# Altium schematic sheet MCU023_XDS110_USB_Power.SchDoc
size 431 x 279 mm; Date: Not shown in title block; ApprovedBy: Not shown in title block; CheckedBy: Not shown in title block; Author: Not shown in title block; CompanyName: Not shown in title block; Engineer: Not shown in title block; Organization: Not shown in title block; Address1: Not shown in title block; Address2: Not shown in title block; Address3: Not shown in title block; Address4: Not shown in title block; DocumentNumber: 1; Revision: Use project parameter SCH_Rev; SheetNumber: 3; SheetTotal: 6; PageSetup: Record=PageOptions|CenterHorizontal=True|CenterVertical=True|PrintScale=1.00|XCorrection=1.00|YCorrection=1.00|PrintKind=0|BorderSize=5000000|LeftOffset=0|BottomOffset=0|Orientation=2|PaperLength=1000|PaperWidth=1000|Scale=100|PaperSource=15|PrintQuality=600|MediaType=1|DitherType=10|PaperKind=Letter|PrintScaleMode=1; CurrentTime: Not shown in title block; CurrentDate: Not shown in title block; Time: Not shown in title block; DocumentFullPathAndName: Not shown in title block; DocumentName: Not shown in title block; ModifiedDate: Not shown in title block; ImagePath: Not shown in title block
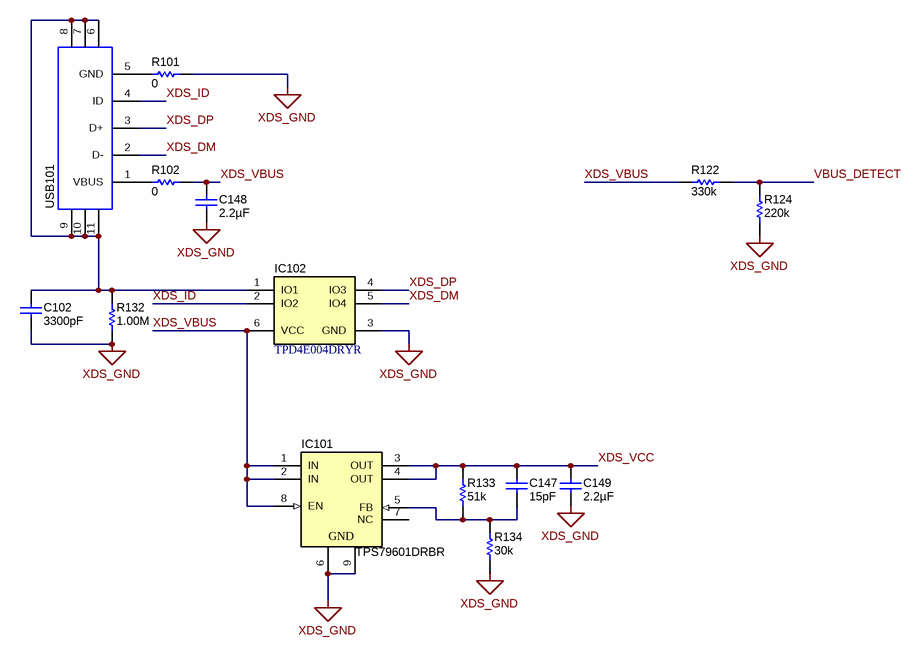
[diagram p0: MCU023_XDS110_USB_Power.SchDoc]

## Parts
C102  ValueDisplayed: 3300pF  [0402]  (hidden comment: GRM155R71H332KA01D)
C147  ValueDisplayed: 15pF  [0402]  (hidden comment: GRM1555C1H150JA01D)
C148  ValueDisplayed: 2.2µF  [0402]  (hidden comment: GRM155R60J225KE95D)
C149  ValueDisplayed: 2.2µF  [0402]  (hidden comment: GRM155R60J225KE95D)
IC101  TPS79601DRBR  [DRB0008B]
IC102  TPD4E004DRYR  [DRY0006A]
R101  ValueDisplayed: 0  [0603]  (hidden comment: CRCW06030000Z0EA)
R102  ValueDisplayed: 0  [0603]  (hidden comment: CRCW06030000Z0EA)
R122  ValueDisplayed: 330k  [0402]  (hidden comment: RC0402FR-07330KL)
R124  ValueDisplayed: 220k  [0402]  (hidden comment: RC0402FR-07220KL)
R132  ValueDisplayed: 1.00M  [0402]  (hidden comment: CRCW04021M00FKED)
R133  ValueDisplayed: 51k  [0402]  (hidden comment: CRCW040251K0JNED)
R134  ValueDisplayed: 30k  [0402]  (hidden comment: CRCW040230K0JNED)
USB101  1051640001  [Molex_1051640001]  (value not drawn)

## Nets
XDS_GND: C102.2 C148.2 C149.2 IC101.6(GND) IC101.9(GND) IC102.3(GND) R101.2 R124.1 R132.1 R134.1
VBUS_DETECT: R122.1 R124.2
XDS_DM: IC102.5(IO4) USB101.2(D-)
XDS_DP: IC102.4(IO3) USB101.3(D+)
XDS_ID: IC102.2(IO2) USB101.4(ID)
XDS_VBUS: C148.1 IC101.1(IN) IC101.2(IN) IC101.8(EN) IC102.6(VCC) R102.2 R122.2
XDS_VCC: C147.1 C149.1 IC101.3(OUT) IC101.4(OUT) R133.2
NetC102_1: C102.1 IC102.1(IO1) R132.2 USB101.6 USB101.7 USB101.8 USB101.9 USB101.10 USB101.11
NetC147_2: C147.2 IC101.5(FB) R133.1 R134.2
NetR101_1: R101.1 USB101.5(GND)
NetR102_1: R102.1 USB101.1(VBUS)

Not connected (* = marked no-connect by the designer): IC101 7(NC)

## Notes on the sheet
- Drawn By:
- SVN Rev:
- Number:
- TID #:
- Orderable:
- Rev:
- Sheet Title:
- File:
- Project Title:
- Designed for:
- Assembly Variant:
- Mod. Date:
- Sheet:
- Size:
- of
- B
- http://www.ti.com
- Texas Instruments and/or its licensors do not warrant the accuracy or completeness of this specification or any information contained therein. Texas Instruments and/or its licensors do not warrant that this design will meet the specifications, will be suitable for your application or fit for any particular purpose, or will operate in an implementation. Texas Instruments and/or its licensors do not warrant that the design is production worthy. You should completely validate and test your design implementation to confirm the system functionality for your application.
- Engineer:
- Contact:
- © Texas Instruments

## Library data of the parts
C102 = GRM155R71H332KA01D: CAP, CERM, 3300 pF, 50 V, +/- 10%, X7R, 0402; Manufacturer: MuRata; Polarized: N; CompType: Capacitor; Value: 3300pF; U/M: EA; Cap_F: 0.0000000033; Tolerance_%: 10; Value1: Unknown; VDC_V: 50; Value2: 50V; TaMin_C: -55; TaMax_C: 125; SizeArea_mm2: 0.5; SizeAreaWB_mm2: 3; SizeX_mm: 1; SizeZ_mm: 0.6; AEC Category: Q200; SymbolVersion: 2008-07-09; PartNumber: GRM155R71H332KA01D; PackageReference: 0402; RoHS: Y; MountType: SMT; Technology: Ceramic; TempCo: X7R; Cap_Case: 0402; SizeY_mm: 0.5; Published: 2008-06-19; Publisher: Texas Instruments; LatestRevisionDate: 2017-04-21; ComponentLink1Description: Datasheet link; ComponentLink1URL: http://search.murata.co.jp/Ceramy/PnsearchViewAction.do?HnOFG=ON&HnNFG=ON&SEL_CNT=50&sLang=en&sKey=GRM155R71H332KA01D&x=9&y=9&search=startwith; Supplier 1: Digi-Key; Supplier Part Number 1: 490-3248-1-ND; Supplier 2: Mouser; Supplier Part Number 2: 81-GRM36X332K50; AEC Qualified: ?
C147 = GRM1555C1H150JA01D: CAP, CERM, 15 pF, 50 V, +/- 5%, C0G/NP0, 0402; Manufacturer: MuRata; Polarized: N; CompType: Capacitor; Value: 15pF; U/M: EA; Cap_F: 0.000000000015; Tolerance_%: 5; Value1: Unknown; VDC_V: 50; Value2: 50V; TaMin_C: -55; TaMax_C: 125; SizeArea_mm2: 0.5; SizeAreaWB_mm2: 3; SizeX_mm: 1; SizeZ_mm: 0.6; AEC Category: Q200; SymbolVersion: 2008-07-09; PartNumber: GRM1555C1H150JA01D; PackageReference: 0402; RoHS: Y; MountType: SMT; Technology: Ceramic; TempCo: C0G/NP0; Cap_Case: 0402; SizeY_mm: 0.5; Published: 2008-06-19; Publisher: Texas Instruments; LatestRevisionDate: 2017-04-21; ComponentLink1Description: Datasheet link; ComponentLink1URL: http://search.murata.co.jp/Ceramy/PnsearchViewAction.do?HnOFG=ON&HnNFG=ON&SEL_CNT=50&sLang=en&sKey=GRM1555C1H150JA01D&x=9&y=9&search=startwith; Supplier 1: Mouser; Supplier Part Number 1: 81-GRM1555C1H150JA1D; AEC Qualified: ?
C148 C149 = GRM155R60J225KE95D: CAP, CERM, 2.2 µF, 6.3 V, +/- 10%, X5R, 0402; Manufacturer: MuRata; Polarized: N; CompType: Capacitor; Value: 2.2uF; U/M: EA; Cap_F: 0.0000022; Tolerance_%: 10; Value1: Unknown; VDC_V: 6.3; Value2: 6.3V; TaMin_C: -55; TaMax_C: 85; SizeArea_mm2: 0.5; SizeAreaWB_mm2: 3; SizeX_mm: 1; SizeZ_mm: 0.6; AEC Category: Q200; SymbolVersion: 2008-07-09; PartNumber: GRM155R60J225KE95D; PackageReference: 0402; RoHS: Y; MountType: SMT; Technology: Ceramic; TempCo: X5R; Cap_Case: 0402; SizeY_mm: 0.5; Published: 2008-06-19; Publisher: Texas Instruments; LatestRevisionDate: 2017-04-21; ComponentLink1Description: Datasheet link; ComponentLink1URL: http://psearch.en.murata.com/capacitor/product/GRM155R60J225KE95%23.pdf; Supplier 1: Mouser; Supplier Part Number 1: 81-GRM155R60J225KE5D; AEC Qualified: N; AEC Grade: N/A
IC101 = TPS79601DRBR: Single Output High PSRR LDO, 1 A, Adjustable 1.2 to 5.5 V Output, 2.7 to 5.5 V Input, 8-pin SON (DRB), -40 to 125 degC, Green (RoHS & no Sb/Br); Manufacturer: Texas Instruments; Alternate PartNumber: Equivalent; Accuracy(%): 2; Iout(Max)(A): 1; Iq(Typ)(mA): 0.26; SubFamily: Single Channel LDO; Vdo(Typ)(mV): 250; Vin(Max)(V): 5.5; Vin(Min)(V): 2.7; Vout Adj(Min)(V): 1.2; Note: TI Supplied; DatasheetVersion: SLVS351N; PackageVersion: 4203482-2/K; PackageReference: DRB0008B; PackageDescription: 8-Pin Plastic Small Outline, Body 3 x 3 mm, Pitch 0.65 mm; Supplier 1: Digi-Key; Supplier Part Number 1: 296-23107-2-ND; Supplier 2: Digi-Key; Supplier Part Number 2: 296-23107-1-ND; Supplier 3: Digi-Key; Supplier Part Number 3: 296-23107-6-ND; Supplier 4: Newark; Supplier Part Number 4: 85M0237; Supplier 5: Mouser; Supplier Part Number 5: 595-TPS79601DRBR; Eco-Plan: Green (RoHS & no Sb/Br); Vout Adj(Max)(V): 5.5; MountType: SMT; PartNumber: TPS79601DRBR; ComponentLink1Description: Manufacturer URL; ComponentLink1URL: http://www.ti.com/; ComponentLink2Description: Datasheet; ComponentLink2URL: http://www.ti.com/general/docs/lit/getliterature.tsp?genericPartNumber=TPS79601&fileType=pdf; ComponentLink3Description: Package Specification; ComponentLink3URL: http://www.ti.com/litv/pdf/mpds118h; Alternate Manufacturer: Texas Instruments
IC102 = TPD4E004DRYR: ESD-Protection Array for High-Speed Data Interfaces, 4 Channels, -40 to +85 degC, 6-pin SON (DRY), Green (RoHS & no Sb/Br); Manufacturer: Texas Instruments; Alternate PartNumber: Equivalent; 1394 / Firewire: TRUE; Breakdown Voltage(Min)(V): 6; IEC 61000-4-2 Air-Gap(+/- kV): 12; IEC 61000-4-2 Contact(+/- kV): 8; IO Capacitance(Typ)(pF): 1.6; IO Leakage Current(nA): 1; SubFamily: ESD Solution; Note: TI Supplied; DatasheetVersion: SLVS729A; PackageVersion: revF, Dec-2011; PackageReference: DRY0006A; PackageDescription: 6-Pin Plastic Small Outline No-Lead, 1 x 1.45 x 0.6 mm Body, 0.5 mm Pitch; Supplier 1: Digi-Key; Supplier Part Number 1: 296-23618-2-ND; Supplier 2: Digi-Key; Supplier Part Number 2: 296-23618-1-ND; Supplier 3: Digi-Key; Supplier Part Number 3: 296-23618-6-ND; Supplier 4: Farnell; Supplier Part Number 4: 1755331; Supplier 5: Newark; Supplier Part Number 5: 85M0177; Supplier 6: Mouser; Supplier Part Number 6: 595-TPD4E004DRYR; Eco-Plan: Green (RoHS & no Sb/Br); Serial ATA / eSATA: TRUE; USB High Speed: TRUE; MountType: SMT; PartNumber: TPD4E004DRYR; ComponentLink1Description: Datasheet; ComponentLink1URL: http://www.ti.com/general/docs/lit/getliterature.tsp?genericPartNumber=TPD4E004&fileType=pdf; ComponentLink2Description: URL Link1; ComponentLink2URL: SamplesURL:http://www.ti.com/product/tpd4e004#samples; Alternate Manufacturer: Texas Instruments
R101 R102 = CRCW06030000Z0EA: RES, 0, 5%, 0.1 W, 0603; Manufacturer: Vishay-Dale; CompType: Resistor; Value: 0; Value_Code: 0000; Tolerance_%: 5; Power_W: 0.1; Value2: 0.1W; VDC_V: 75; TempCo: 200 ppm/C; SizeArea_mm2: 1.28; SizeX_mm: 1.6; SizeY_mm: 0.8; SizeZ_mm: 1; EIA_Code: E24; U/M: EA; AEC Category: Q200; Green_Lifecycle: Active; Green_REACh: Passed; SymbolVersion: 2009-05-29; PartNumber: CRCW06030000Z0EA; PackageReference: 0603; RoHS: Y; Res_ohm: 0; Value1: 5%; MountType: SMT; Technology: Thick Film; Published: 2008-06-26; Publisher: Texas Instruments; LatestRevisionDate: 2017-05-04; ComponentLink1Description: Datasheet link; ComponentLink1URL: http://www.vishay.com/docs/20035/dcrcwe3.pdf; Supplier 1: Digi-Key; Supplier Part Number 1: 541-0.0GCT-ND; Supplier 2: Newark; Supplier Part Number 2: 52K8014; Supplier 3: Mouser; Supplier Part Number 3: 71-CRCW0603-0-E3; AEC Qualified: ?; Green_EU RoHS: Passed with Exemption; Green_EU RoHS-2: Passed
R122 = RC0402FR-07330KL: RES, 330 k, 1%, 0.0625 W, 0402; Manufacturer: Yageo America; CompType: Resistor; Value: 330k; Res_ohm: 330000; Tolerance_%: 1; Power_W: 0.0625; VDC_V: 50; TempCo: 100 ppm/C; SizeArea_mm2: 0.5; SizeZ_mm: 0.6; U/M: EA; AEC Category: Q200; AEC Qualified: N; SymbolVersion: 2009-05-29; PartNumber: RC0402FR-07330KL; PackageReference: 0402; RoHS: Y; Value_Code: 330k; Value1: 1%; Value2: 0.0625W; MountType: SMT; Technology: Thick Film; SizeX_mm: 1; SizeY_mm: 0.5; Published: 2008-06-26; Publisher: Texas Instruments; LatestRevisionDate: 2017-04-13; ComponentLink1Description: Datasheet link; ComponentLink1URL: http://www.yageo.com/documents/recent/PYu-RC0402_51_RoHS_L_6_r.pdf; Supplier 1: Digi-Key; Supplier Part Number 1: 311-330KLRCT-ND; Supplier 2: Newark; Supplier Part Number 2: 98K7541; Supplier 3: Mouser; Supplier Part Number 3: 603-RC0402FR-07330KL; AEC Grade: N/A
R124 = RC0402FR-07220KL: RES, 220 k, 1%, 0.0625 W, 0402; Manufacturer: Yageo America; CompType: Resistor; Value: 220k; Res_ohm: 220000; Tolerance_%: 1; Power_W: 0.0625; VDC_V: 50; TempCo: 100 ppm/C; SizeArea_mm2: 0.5; SizeZ_mm: 0.6; U/M: EA; AEC Category: Q200; AEC Qualified: N; SymbolVersion: 2009-05-29; PartNumber: RC0402FR-07220KL; PackageReference: 0402; RoHS: Y; Value_Code: 220k; Value1: 1%; Value2: 0.0625W; MountType: SMT; Technology: Thick Film; SizeX_mm: 1; SizeY_mm: 0.5; Published: 2008-06-26; Publisher: Texas Instruments; LatestRevisionDate: 2017-04-13; ComponentLink1Description: Datasheet link; ComponentLink1URL: http://www.yageo.com/documents/recent/PYu-RC0402_51_RoHS_L_6_r.pdf; Supplier 1: Digi-Key; Supplier Part Number 1: 311-220KLRCT-ND; Supplier 2: Newark; Supplier Part Number 2: 98K7527; Supplier 3: Mouser; Supplier Part Number 3: 603-RC0402FR-07220KL; AEC Grade: N/A
R132 = CRCW04021M00FKED: RES, 1.00 M, 1%, 0.063 W, 0402; Manufacturer: Vishay-Dale; CompType: Resistor; Value: 1.00Meg; Res_ohm: 1000000; Value_Code: 1M00; Tolerance_%: 1; Power_W: 0.063; Value2: 0.063W; VDC_V: 50; TempCo: 100 ppm/C; SizeArea_mm2: 0.5; SizeZ_mm: 0.6; EIA_Code: E96; U/M: EA; AEC Category: Q200; SymbolVersion: 2009-05-29; PartNumber: CRCW04021M00FKED; PackageReference: 0402; RoHS: Y; Value1: 1%; MountType: SMT; Technology: Thick Film; SizeX_mm: 1; SizeY_mm: 0.5; Published: 2008-06-26; Publisher: Texas Instruments; LatestRevisionDate: 2017-04-13; ComponentLink1Description: Datasheet link; ComponentLink1URL: http://www.vishay.com/docs/20035/dcrcwe3.pdf; Supplier 1: Digi-Key; Supplier Part Number 1: 541-1.00MLCT-ND; Supplier 2: Newark; Supplier Part Number 2: 52K6593; Supplier 3: Mouser; Supplier Part Number 3: 71-CRCW0402-1.0M-E3; AEC Qualified: ?
R133 = CRCW040251K0JNED: RES, 51 k, 5%, 0.063 W, 0402; Manufacturer: Vishay-Dale; CompType: Resistor; Value: 51k; Res_ohm: 51000; Value_Code: 51k0; Tolerance_%: 5; Power_W: 0.063; Value2: 0.063W; VDC_V: 50; TempCo: 200 ppm/C; SizeArea_mm2: 0.5; SizeX_mm: 1; SizeZ_mm: 0.6; EIA_Code: E24; U/M: EA; AEC Category: Q200; SymbolVersion: 2009-05-29; PartNumber: CRCW040251K0JNED; PackageReference: 0402; RoHS: Y; Value1: 5%; MountType: SMT; Technology: Thick Film; SizeY_mm: 0.5; Published: 2008-06-26; Publisher: Texas Instruments; LatestRevisionDate: 2017-04-13; ComponentLink1Description: Datasheet link; ComponentLink1URL: http://www.vishay.com/docs/20035/dcrcwe3.pdf; Supplier 1: Digi-Key; Supplier Part Number 1: 541-51KJCT-ND; Supplier 2: Newark; Supplier Part Number 2: 89M6676; Supplier 3: Mouser; Supplier Part Number 3: 71-CRCW0402J-51K-E3; AEC Qualified: ?
R134 = CRCW040230K0JNED: RES, 30 k, 5%, 0.063 W, 0402; Manufacturer: Vishay-Dale; CompType: Resistor; Value: 30k; Res_ohm: 30000; Value_Code: 30k0; Tolerance_%: 5; Power_W: 0.063; Value2: 0.063W; VDC_V: 50; TempCo: 200 ppm/C; SizeArea_mm2: 0.5; SizeX_mm: 1; SizeZ_mm: 0.6; EIA_Code: E24; U/M: EA; AEC Category: Q200; SymbolVersion: 2009-05-29; PartNumber: CRCW040230K0JNED; PackageReference: 0402; RoHS: Y; Value1: 5%; MountType: SMT; Technology: Thick Film; SizeY_mm: 0.5; Published: 2008-06-26; Publisher: Texas Instruments; LatestRevisionDate: 2017-04-13; ComponentLink1Description: Datasheet link; ComponentLink1URL: http://www.vishay.com/docs/20035/dcrcwe3.pdf; Supplier 1: Digi-Key; Supplier Part Number 1: 541-30KJCT-ND; Supplier 2: Newark; Supplier Part Number 2: 59M6726; Supplier 3: Mouser; Supplier Part Number 3: 71-CRCW0402J-30K-E3; AEC Qualified: ?
USB101 = 1051640001: Receptacle, USB 2.0, Micro B, 5 Position, R/A, SMT; Manufacturer: Molex; SymbolCreator: a0411947; Pitch_mm: 0.65; Gender: Female; ContactFinish: Gold; Current_A: 1.8; Voltage_V: 30; Cert_UL: Y; SymbolVersion: 2013-12-17; PartNumber: 1051640001; PackageReference: Receptacle, USB 2.0, Micro B, 5 Pos, 0.65mm Pitch, R/A, SMT; CompType: Receptacle; RoHS: Y; MountType: SMT; ComponentLink1Description: Datasheet URL; ComponentLink1URL: http://www.molex.com/pdm_docs/sd/1051640001_sd.pdf; Orientation: R/A; PinCount: 5; Color: Black; Publisher: Texas Instruments; LatestRevisionDate: 2017-03-28; Supplier 1: Digi-Key; Supplier Part Number 1: WM11263CT-ND; Supplier 2: Newark; Supplier Part Number 2: 99Y3224; Supplier 3: Mouser; Supplier Part Number 3: 538-105164-0001